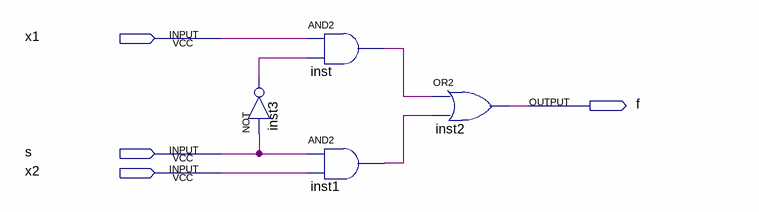
[diagram p0: schematic sheet]
// Quartus schematic mux2-to-1.bdf as structural Verilog: 4 symbols, 4 pins
module \mux2-to-1  (
  input  x1,
  input  s,
  input  x2,
  output f
);

  wire inst1_out, inst3_out, inst_out;

  not inst3 (inst3_out, s);
  and inst (inst_out, x1, inst3_out);
  and inst1 (inst1_out, s, x2);
  or inst2 (f, inst_out, inst1_out);
endmodule
